# Altium schematic sheet Mechanical.SchDoc
size A4; SheetNumber: 3; SheetTotal: 8
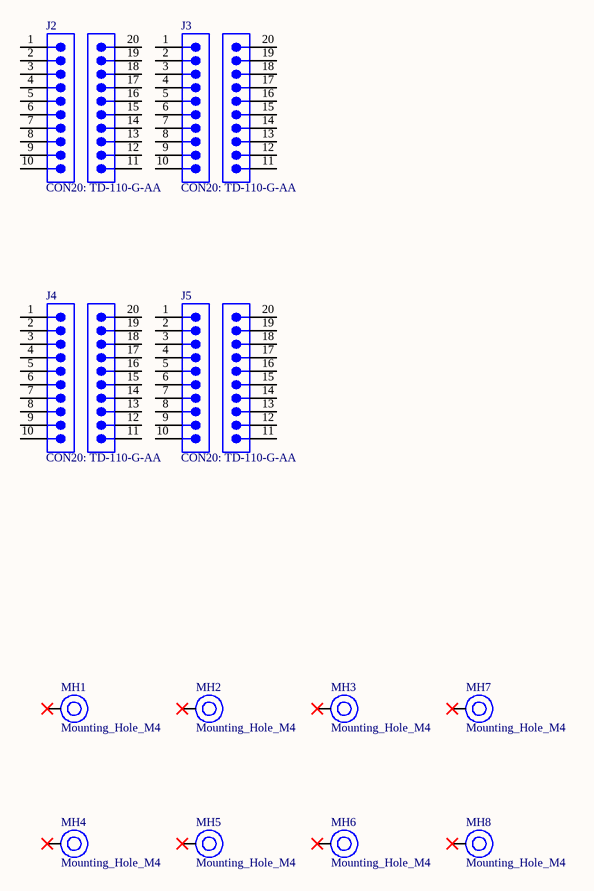
[diagram p0: Mechanical.SchDoc]

## Parts
J2  CON20: TD-110-G-AA  [CON20: TD-110-G-AA]  (mechanical)
J3  CON20: TD-110-G-AA  [CON20: TD-110-G-AA]  (mechanical)
J4  CON20: TD-110-G-AA  [CON20: TD-110-G-AA]  (mechanical)
J5  CON20: TD-110-G-AA  [CON20: TD-110-G-AA]  (mechanical)
MH1  Mounting_Hole_M4  [Mounting_Hole_M4]
MH2  Mounting_Hole_M4  [Mounting_Hole_M4]
MH3  Mounting_Hole_M4  [Mounting_Hole_M4]
MH4  Mounting_Hole_M4  [Mounting_Hole_M4]
MH5  Mounting_Hole_M4  [Mounting_Hole_M4]
MH6  Mounting_Hole_M4  [Mounting_Hole_M4]
MH7  Mounting_Hole_M4  [Mounting_Hole_M4]
MH8  Mounting_Hole_M4  [Mounting_Hole_M4]

## Nets

Not connected (* = marked no-connect by the designer): J2 1 2 3 4 5 6 7 8 9 10 11(70) 12 13 14 15 16 17 18 19 20; J3 1 2 3 4 5 6 7 8 9 10 11(70) 12 13 14 15 16 17 18 19 20; J4 1 2 3 4 5 6 7 8 9 10 11(70) 12 13 14 15 16 17 18 19 20; J5 1 2 3 4 5 6 7 8 9 10 11(70) 12 13 14 15 16 17 18 19 20; MH1 1*; MH2 1*; MH3 1*; MH4 1*; MH5 1*; MH6 1*; MH7 1*; MH8 1*

## Library data of the parts
J2-J5 = CON20: TD-110-G-AA: Pin Header, Precision Machined Terminal, Board-to-Board, 2.54 mm, 2 Rows, 20 Contacts, Through Hole; Manufacturer: Samtec; Manufacturer Lifecycle Status: PRODUCTION; Number of Contacts: 20; Supplier: DigiKey; Supplier Part Number: TD-110-G-AA-ND; Manufacturer Part Number: TD-110-G-AA; RoHS: Compliant; Category: Headers and Wire Housings; Stock: 586; Pricing: 1=4.66, 25=4.21, 50=3.92, 100=3.73, 500=2.96, 1000=2.70002, 2500=2.6604 (USD); Contact Material: Gold, Nickel; Contact Plating: Gold; Lifecycle Status: Production; Max Operating Temperature: 125°C; Min Operating Temperature: -55°C; Mounting Technology: Through Hole; Number of Rows: 2; REACH SVHC: No; Termination: Through Hole; ComponentLink1URL: https://datasheet.octopart.com:443/TD-110-G-AA-Samtec-datasheet-158277479.pdf?src-supplier=Upverter; ComponentLink1Description: https://datasheet.octopart.com:443/TD-110-G-AA-Samtec-datasheet-158277479.pdf?src-supplier=Upverter; ComponentLink2URL: https://sigma.octopart.com:443/138897476/technical_drawing/Samtec-TD-110-G-AA.pdf?src-supplier=Upverter; ComponentLink2Description: https://sigma.octopart.com:443/138897476/technical_drawing/Samtec-TD-110-G-AA.pdf?src-supplier=Upverter; ComponentLink3URL: https://datasheet.octopart.com:443/TD-110-G-AA-Samtec-datasheet-97310231.pdf?src-supplier=Samtec; ComponentLink3Description: https://datasheet.octopart.com:443/TD-110-G-AA-Samtec-datasheet-97310231.pdf?src-supplier=Samtec; ComponentLink4URL: https://datasheet.octopart.com:443/TD-110-G-AA-Samtec-datasheet-150856305.pdf?src-supplier=Sager+Electronics; ComponentLink4Description: https://datasheet.octopart.com:443/TD-110-G-AA-Samtec-datasheet-150856305.pdf?src-supplier=Sager+Electronics; ComponentLink5URL: https://datasheet.octopart.com:443/TD-110-G-AA-Samtec-datasheet-129019458.pdf?src-supplier=Sager+Electronics; ComponentLink5Description: https://datasheet.octopart.com:443/TD-110-G-AA-Samtec-datasheet-129019458.pdf?src-supplier=Sager+Electronics; ComponentLink6URL: https://datasheet.octopart.com:443/TD-110-G-AA-Samtec-datasheet-179090728.pdf?src-supplier=Sager+Electronics; ComponentLink6Description: https://datasheet.octopart.com:443/TD-110-G-AA-Samtec-datasheet-179090728.pdf?src-supplier=Sager+Electronics; ComponentLink7URL: https://datasheet.octopart.com:443/TD-110-G-AA-Samtec-datasheet-41643126.pdf?src-supplier=Farnell; ComponentLink7Description: https://datasheet.octopart.com:443/TD-110-G-AA-Samtec-datasheet-41643126.pdf?src-supplier=Farnell; ComponentLink8URL: https://datasheet.octopart.com:443/TD-110-G-AA-Samtec-datasheet-37173861.pdf?src-supplier=Farnell; ComponentLink8Description: https://datasheet.octopart.com:443/TD-110-G-AA-Samtec-datasheet-37173861.pdf?src-supplier=Farnell; ComponentLink9URL: https://datasheet.octopart.com:443/TD-110-G-AA-Samtec-datasheet-8466599.pdf?src-supplier=Farnell; ComponentLink9Description: https://datasheet.octopart.com:443/TD-110-G-AA-Samtec-datasheet-8466599.pdf?src-supplier=Farnell; ComponentLink10URL: https://datasheet.octopart.com:443/TD-110-G-AA-Samtec-datasheet-21214653.pdf?src-supplier=Newark; ComponentLink10Description: https://datasheet.octopart.com:443/TD-110-G-AA-Samtec-datasheet-21214653.pdf?src-supplier=Newark
MH1-MH8 = CMP-293-000000-1: Mounting Hole M4; Component Type: Mechanical; Design Item ID: Mounting_Hole_M4; Pin Count: 1; Source: Electromechanical.SchLib